# Altium schematic sheet CS5463.SchDoc
size A4
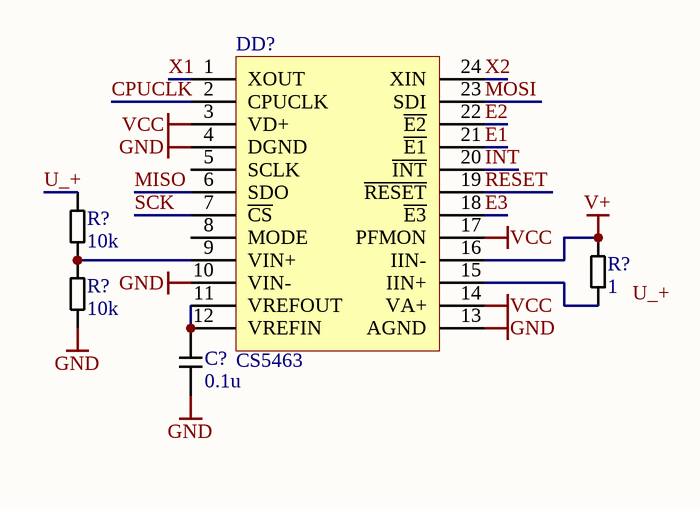
[diagram p0: CS5463.SchDoc]

## Parts
(Parts that share a designator on the sheet are numbered #1, #2 ... from top to bottom, then left to right.)
C?  0.1u  [C0603]
DD?  CS5463  [TSSOP-24]
R?#1  10k  [R0603]
R?#2  10k  [R0603]
R?#3  1  [R0603]

## Nets
GND: C?.2 DD?.4(DGND) DD?.10(VIN-) DD?.13(AGND) R?#2.1
V+: DD?.16(IIN-) R?#3.1
VCC: DD?.3(VD+) DD?.14(VA+) DD?.17(PFMON)
CPUCLK: DD?.2(CPUCLK)
E1: DD?.21(~{E1})
E2: DD?.22(~{E2})
E3: DD?.18(~{E3})
INT: DD?.20(~{INT})
MISO: DD?.6(SDO)
MOSI: DD?.23(SDI)
RESET: DD?.19(~{RESET})
SCK: DD?.7(~{CS})
U_+: R?#1.1
X1: DD?.1(XOUT)
X2: DD?.24(XIN)
NetC?_1: C?.1 DD?.11(VREFOUT) DD?.12(VREFIN)
NetDD?_9: DD?.9(VIN+) R?#1.2 R?#2.2
NetDD?_15: DD?.15(IIN+) R?#3.2

Not connected (* = marked no-connect by the designer): DD? 5(SCLK) 8(MODE)

## Notes on the sheet
- Labels drawn without touching a wire or pin: U_+

## Library data of the parts
C? = C: Capacitor
DD? = CS5463: Power/Energy metering IC
R?#1-R?#3 = R: Resistor